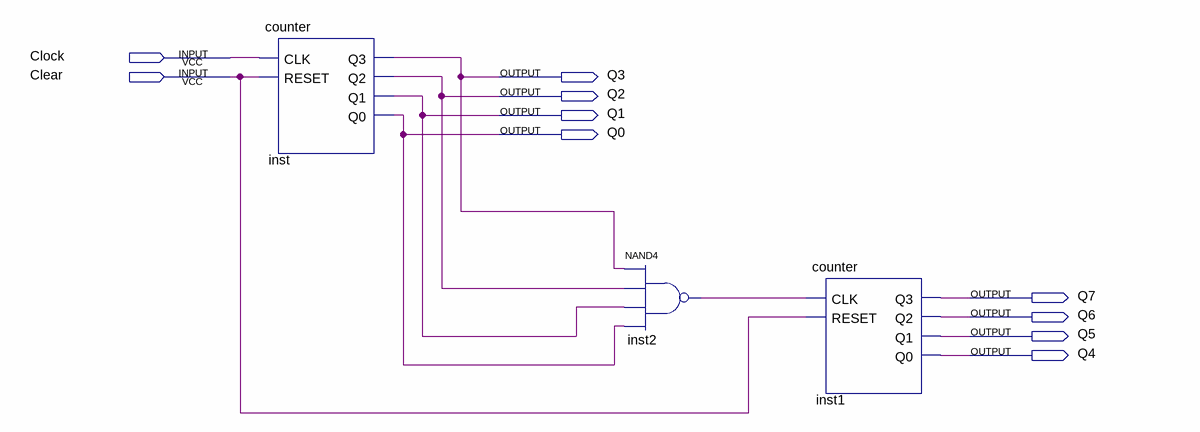
[diagram p0: schematic sheet]
// Quartus schematic Contador256.bdf as structural Verilog: 3 symbols, 10 pins
module Contador256 (
  input  Clock,
  input  Clear,
  output Q3,
  output Q2,
  output Q1,
  output Q0,
  output Q7,
  output Q6,
  output Q5,
  output Q4
);

  wire inst2_out;

  counter inst (.CLK(Clock), .RESET(Clear), .Q3(Q3), .Q2(Q2), .Q1(Q1), .Q0(Q0));
  nand inst2 (inst2_out, Q3, Q2, Q1, Q0);
  counter inst1 (.CLK(inst2_out), .RESET(Clear), .Q3(Q7), .Q2(Q6), .Q1(Q5), .Q0(Q4));
endmodule
